# EasyEDA schematic SCH_Krishveer's-OsuPad_2025-02-05.json
TITLE: Sheet_1; REV: 1.0; Date: 2025-01-28; Sheet: 1/1; Drawn By: krishveersinghkhurana; Company: Your Company
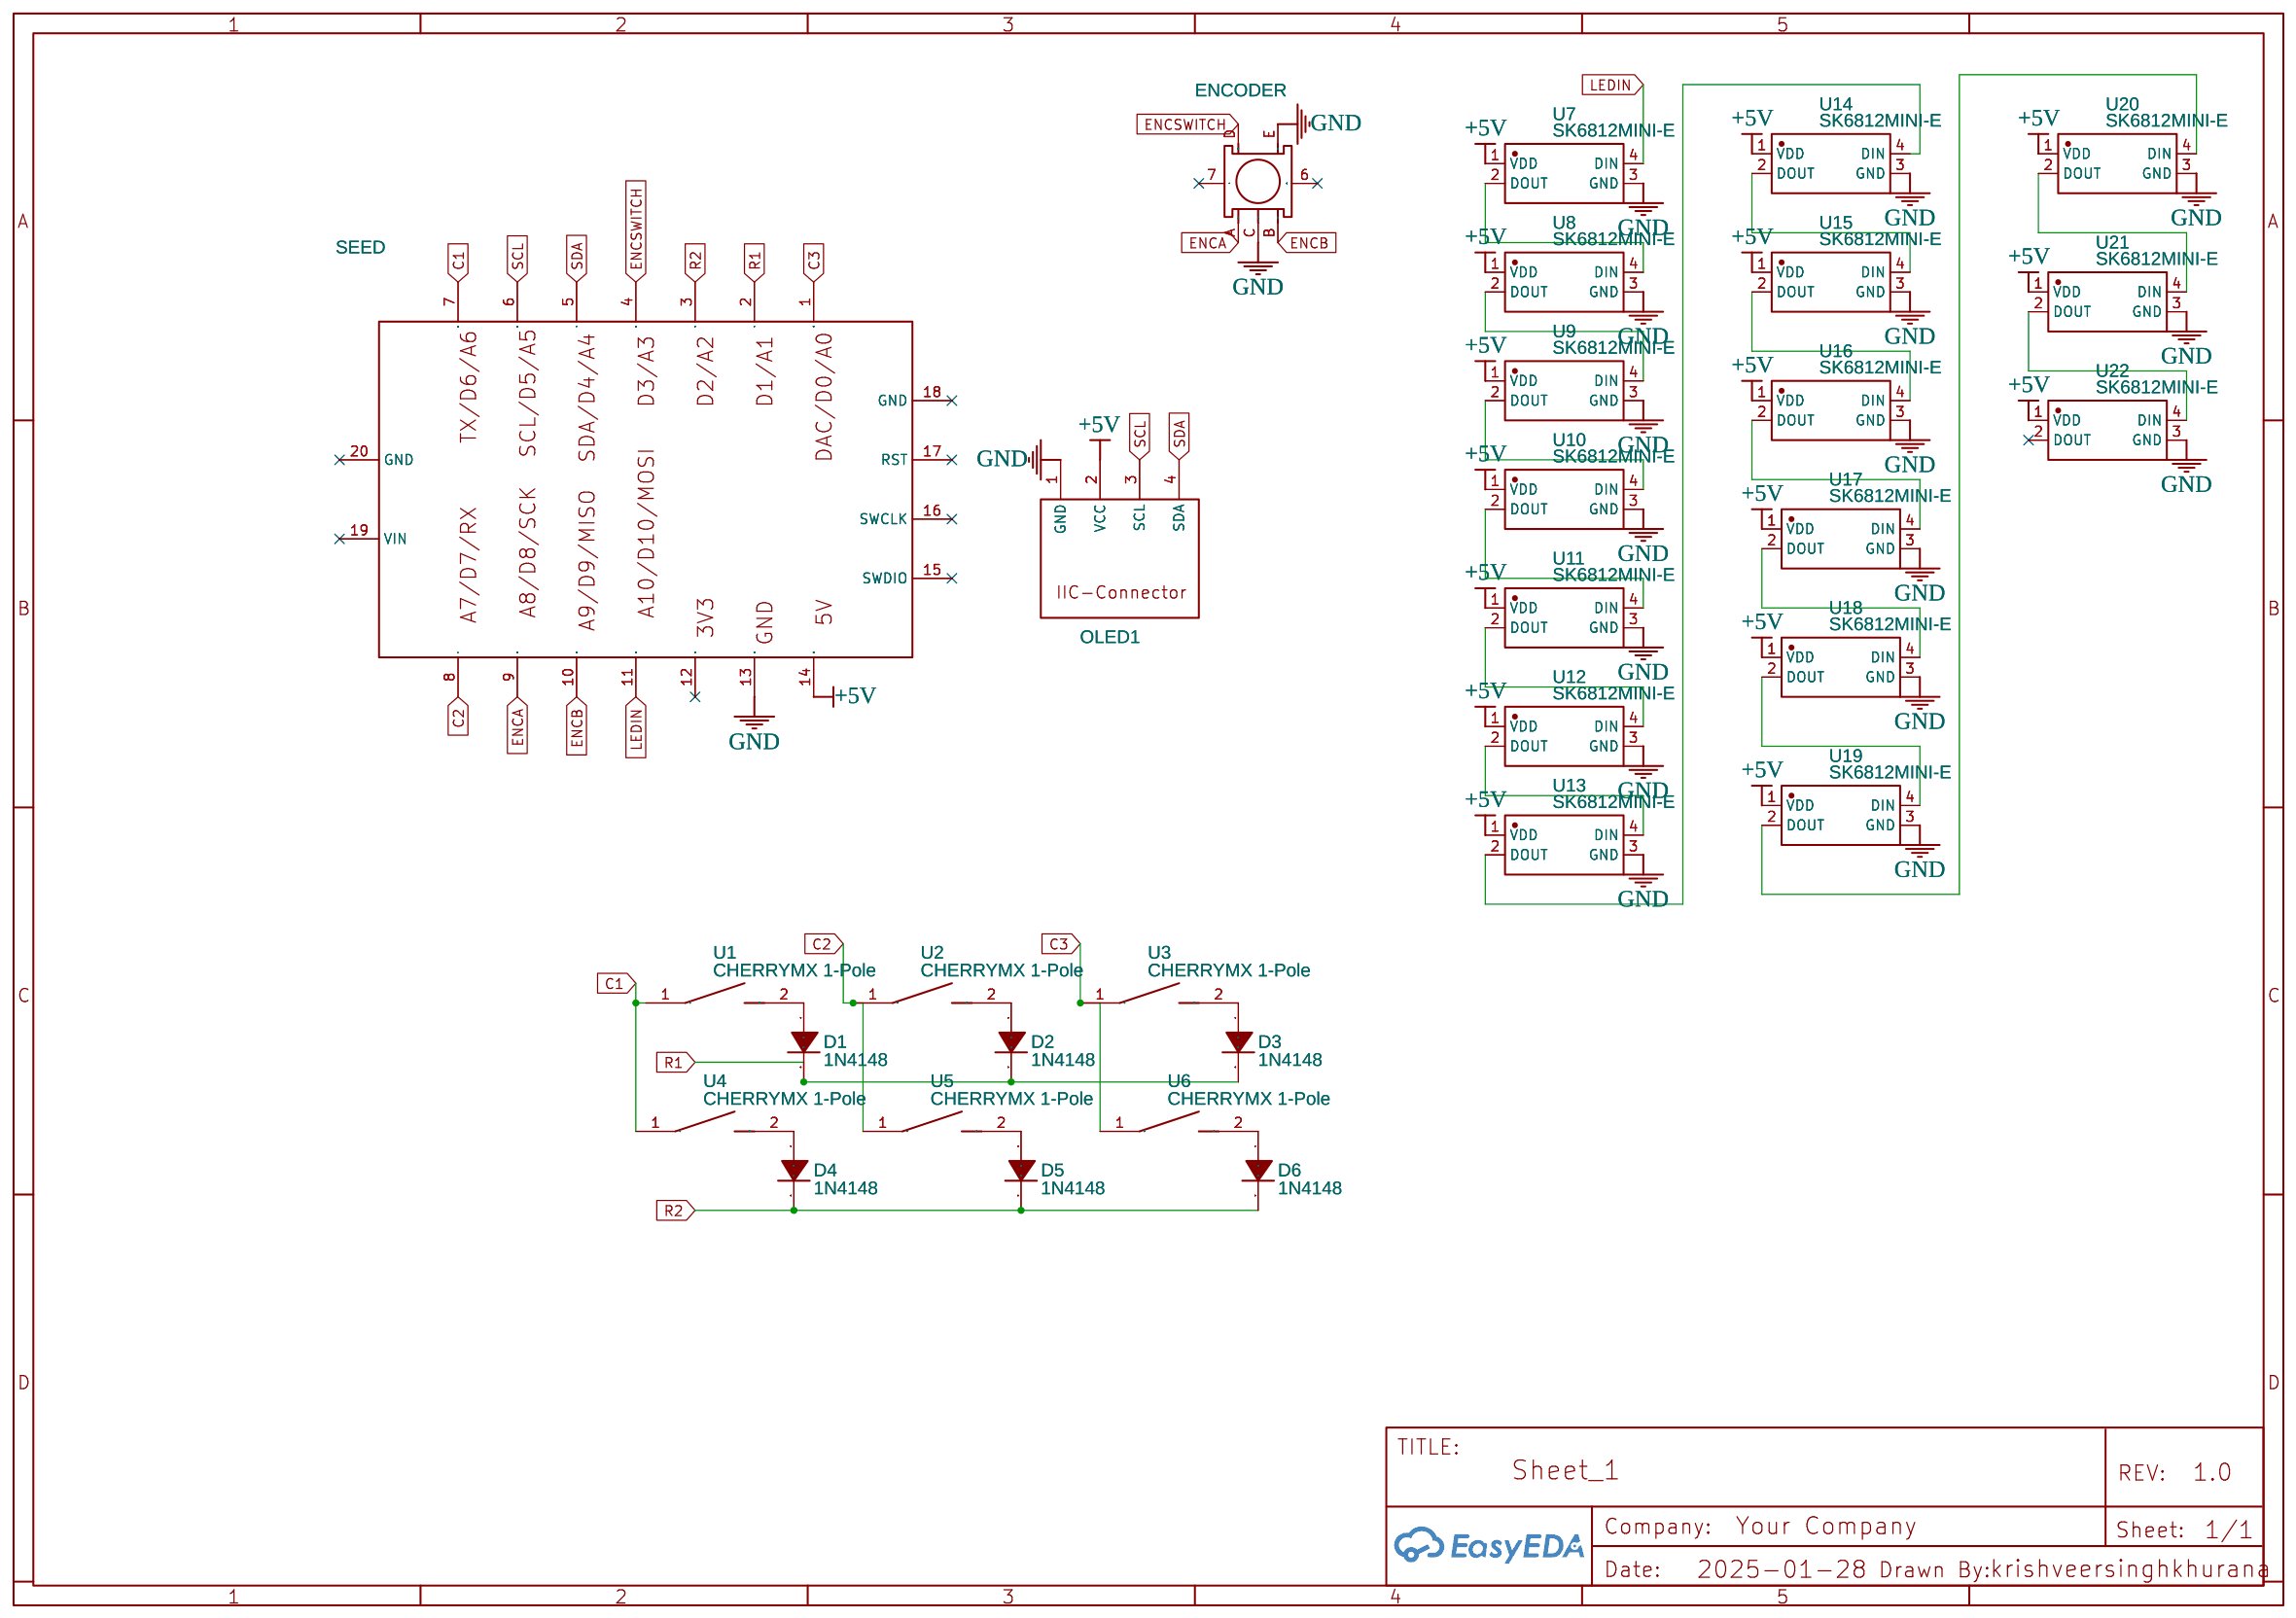
[diagram p0: schematic sheet]

## Parts
D1  1N4148  [DO-35_BD2.0-L4.0-P8.00-D0.5-FD]
D2  1N4148  [DO-35_BD2.0-L4.0-P8.00-D0.5-FD]
D3  1N4148  [DO-35_BD2.0-L4.0-P8.00-D0.5-FD]
D4  1N4148  [DO-35_BD2.0-L4.0-P8.00-D0.5-FD]
D5  1N4148  [DO-35_BD2.0-L4.0-P8.00-D0.5-FD]
D6  1N4148  [DO-35_BD2.0-L4.0-P8.00-D0.5-FD]
ENCODER  EC11E09244AQ  [SW-TH_EC11XXXXXXXX]
OLED1  0.96OLED_4P_MODULE_JX  [0.96OLED_4P]
SEED  Seeed XIAO RP2040 ALL PINS  [SEEED XIAO RP2040]
U1  CHERRYMX 1-Pole  [CHERRY MX]
U2  CHERRYMX 1-Pole  [CHERRY MX]
U3  CHERRYMX 1-Pole  [CHERRY MX]
U4  CHERRYMX 1-Pole  [CHERRY MX]
U5  CHERRYMX 1-Pole  [CHERRY MX]
U6  CHERRYMX 1-Pole  [CHERRY MX]
U7  SK6812MINI-E  [LED-SMD_L3.2-W2.8-P1.50-LS5.8-TR-EH]
U8  SK6812MINI-E  [LED-SMD_L3.2-W2.8-P1.50-LS5.8-TR-EH]
U9  SK6812MINI-E  [LED-SMD_L3.2-W2.8-P1.50-LS5.8-TR-EH]
U10  SK6812MINI-E  [LED-SMD_L3.2-W2.8-P1.50-LS5.8-TR-EH]
U11  SK6812MINI-E  [LED-SMD_L3.2-W2.8-P1.50-LS5.8-TR-EH]
U12  SK6812MINI-E  [LED-SMD_L3.2-W2.8-P1.50-LS5.8-TR-EH]
U13  SK6812MINI-E  [LED-SMD_L3.2-W2.8-P1.50-LS5.8-TR-EH]
U14  SK6812MINI-E  [LED-SMD_L3.2-W2.8-P1.50-LS5.8-TR-EH]
U15  SK6812MINI-E  [LED-SMD_L3.2-W2.8-P1.50-LS5.8-TR-EH]
U16  SK6812MINI-E  [LED-SMD_L3.2-W2.8-P1.50-LS5.8-TR-EH]
U17  SK6812MINI-E  [LED-SMD_L3.2-W2.8-P1.50-LS5.8-TR-EH]
U18  SK6812MINI-E  [LED-SMD_L3.2-W2.8-P1.50-LS5.8-TR-EH]
U19  SK6812MINI-E  [LED-SMD_L3.2-W2.8-P1.50-LS5.8-TR-EH]
U20  SK6812MINI-E  [LED-SMD_L3.2-W2.8-P1.50-LS5.8-TR-EH]
U21  SK6812MINI-E  [LED-SMD_L3.2-W2.8-P1.50-LS5.8-TR-EH]
U22  SK6812MINI-E  [LED-SMD_L3.2-W2.8-P1.50-LS5.8-TR-EH]

## Library data of the parts
D1-D6 = 1N4148: Supplier: LCSC; Manufacturer: ST(先科); Supplier Part: C14516; JLCPCB Part Class: Extended Part
ENCODER = EC11E09244AQ: Contributor: LCSC; Supplier: LCSC; Supplier Part: C470753; Manufacturer: ALPSALPINE(阿尔卑斯阿尔派); JLCPCB Part Class: Extended Part
OLED1 = 0.96OLED_4P_MODULE_JX: Contributor: LCSC; Supplier: LCSC; Supplier Part: C9900004566; Manufacturer: null; JLCPCB Part Class: Extended Part
SEED = Seeed XIAO RP2040 ALL PINS: Manufacturer: Seeedstudio; Manufacturer Part: 102010328; link: https://www.seeedstudio.com/Seeeduino-XIAO-Arduino-Microcontroller-SAMD21-Cortex-M0+-p-4426.html; Contributor: mkyo2001
U1-U6 = CHERRYMX 1-Pole: Manufacturer Part: Red RGB; Contributor: en129; Supplier: Reichelt; link: https://www.reichelt.de/cherry-mx-red-rgb-tastenmodul-cherry-mx1a-l1na-p258098.html?&trstct=pos_6&nbc=1
U7-U22 = SK6812MINI-E: Contributor: LCSC; Supplier: LCSC; Supplier Part: C9900001298; Manufacturer: null; JLCPCB Part Class: Extended Part

## Nets
+5V: OLED1.2(VCC) SEED.14(13) U7.1(VDD) U8.1(VDD) U9.1(VDD) U10.1(VDD) U11.1(VDD) U12.1(VDD) U13.1(VDD) U14.1(VDD) U15.1(VDD) U16.1(VDD) U17.1(VDD) U18.1(VDD) U19.1(VDD) U20.1(VDD) U21.1(VDD) U22.1(VDD)
GND: ENCODER.C ENCODER.E OLED1.1(GND) SEED.13(12) U7.3(GND) U8.3(GND) U9.3(GND) U10.3(GND) U11.3(GND) U12.3(GND) U13.3(GND) U14.3(GND) U15.3(GND) U16.3(GND) U17.3(GND) U18.3(GND) U19.3(GND) U20.3(GND) U21.3(GND) U22.3(GND)
C1: SEED.7(6) U1.1 U4.1
C2: SEED.8(7) U2.1 U5.1
C3: SEED.1(0) U3.1 U6.1
ENCA: ENCODER.A SEED.9(8)
ENCB: ENCODER.B SEED.10(9)
ENCSWITCH: ENCODER.D SEED.4(3)
LEDIN: SEED.11(10) U7.4(DIN)
R1: D1.2(C) D2.2(C) D3.2(C) SEED.2(1)
R2: D4.2(C) D5.2(C) D6.2(C) SEED.3(2)
SCL: OLED1.3(SCL) SEED.6(5)
SDA: OLED1.4(SDA) SEED.5(4)
Net-(D1-1): D1.1(A) U1.2
Net-(D2-1): D2.1(A) U2.2
Net-(D3-1): D3.1(A) U3.2
Net-(D4-1): D4.1(A) U4.2
Net-(D5-1): D5.1(A) U5.2
Net-(D6-1): D6.1(A) U6.2
Net-(U7-2): U7.2(DOUT) U8.4(DIN)
Net-(U8-2): U8.2(DOUT) U9.4(DIN)
Net-(U9-2): U9.2(DOUT) U10.4(DIN)
Net-(U10-2): U10.2(DOUT) U11.4(DIN)
Net-(U11-2): U11.2(DOUT) U12.4(DIN)
Net-(U12-2): U12.2(DOUT) U13.4(DIN)
Net-(U13-2): U13.2(DOUT) U14.4(DIN)
Net-(U14-2): U14.2(DOUT) U15.4(DIN)
Net-(U15-2): U15.2(DOUT) U16.4(DIN)
Net-(U16-2): U16.2(DOUT) U17.4(DIN)
Net-(U17-2): U17.2(DOUT) U18.4(DIN)
Net-(U18-2): U18.2(DOUT) U19.4(DIN)
Net-(U19-2): U19.2(DOUT) U20.4(DIN)
Net-(U20-2): U20.2(DOUT) U21.4(DIN)
Net-(U21-2): U21.2(DOUT) U22.4(DIN)

Not connected (* = marked no-connect by the designer): ENCODER 6* 7*; SEED 12(11)* 15(SWDIO)* 16(SWCLK)* 17(RST)* 18(GND)* 19(VIN)* 20(GND)*; U22 2(DOUT)*
